# Altium schematic sheet Sheet1.SchDoc
size A; SheetNumber: 1; SheetTotal: 1
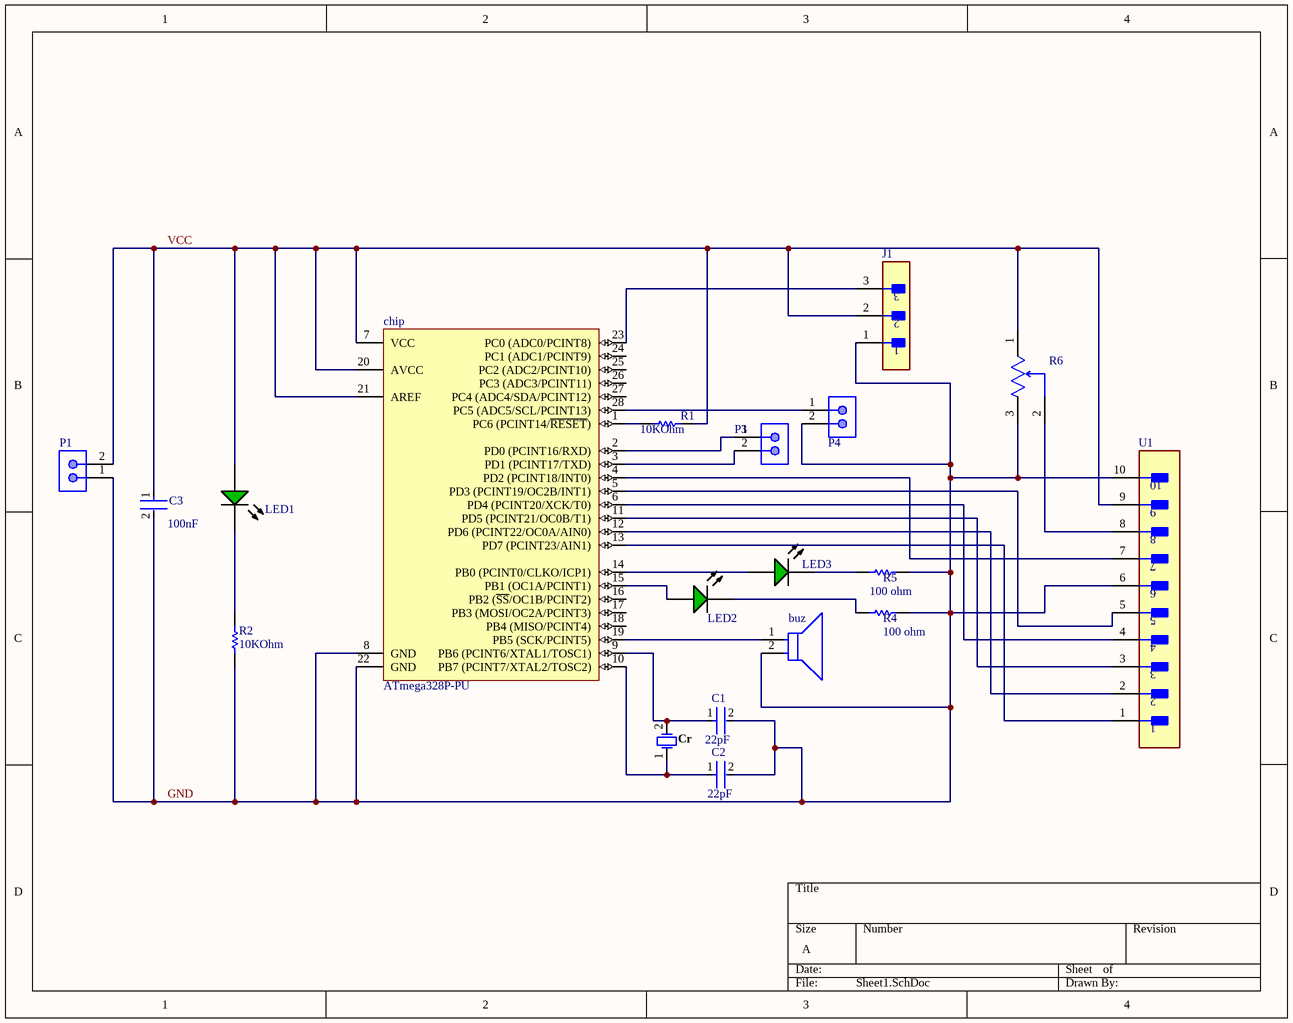
[diagram p0: Sheet1.SchDoc]

## Parts
buz  PS1440P02BT  [FP-PS1440P02BT-MFG]  (value not drawn)
C1  Capacitance: 22pF  [FP-RCE0DB-MFG]  (hidden comment: RCE5C2A220J0DBH03A)
C2  Capacitance: 22pF  [FP-RCE0DB-MFG]  (hidden comment: RCE5C2A220J0DBH03A)
C3  Capacitance: 100nF  [FP-K15H5-MFG]  (hidden comment: K104K15X7RF53H5)
chip  ATmega328P-PU  [28P3]
Cr  FOXSLF/160-20  [FOX-FOXSLF160-20]  (value not drawn)
J1  TMM-103-03-T-S  [FP-TMM-103-03-T-S-MFG]  (value not drawn)
LED1  HLMP-1790  [LED-2P-2.54-3MM_V]  (value not drawn)
LED2  HLMP-1790  [LED-2P-2.54-3MM_V]  (value not drawn)
LED3  HLMP-1790  [LED-2P-2.54-3MM_V]  (value not drawn)
P1  22-27-2021  [MOLX-22-27-2021_V]  (value not drawn)
P3  22-27-2021  [MOLX-22-27-2021_V]  (value not drawn)
P4  22-27-2021  [MOLX-22-27-2021_V]  (value not drawn)
R1  Resistance: 10KOhm  [RESA60-630X240]  (hidden comment: MFR-25FBF5210K)
R2  Resistance: 10KOhm  [RESA60-630X240]  (hidden comment: MFR-25FBF5210K)
R4  Resistance: 100 ohm  [RESA60-630X240]  (hidden comment: MFR-25FBF52-1K)
R5  Resistance: 100 ohm  [RESA60-630X240]  (hidden comment: MFR-25FBF52-1K)
R6  3296W-1-202LF  [FP-3296W-MFG]  (value not drawn)
U1  61301011121  [FP-61301011121-MFG]  (value not drawn)

## Nets
GND: buz.2 C1.2 C2.2 C3.2 chip.8(GND) chip.22(GND) J1.1 P1.1 P4.2 R2.1 R4.2 R5.2 R6.3(CW) U1.6 U1.10
VCC: C3.1 chip.7(VCC) chip.20(AVCC) chip.21(AREF) J1.2 LED1.1(A) P1.2 R1.2 R6.1(CCW) U1.9
Netbuz_1: buz.1 chip.19(PB5_(SCK/PCINT5))
NetC1_1: C1.1 chip.9(PB6_(PCINT6/XTAL1/TOSC1)) Cr.2
NetC2_1: C2.1 chip.10(PB7_(PCINT7/XTAL2/TOSC2)) Cr.1
Netchip_1: chip.1(PC6_(PCINT14/~{RESET})) R1.1
Netchip_2: chip.2(PD0_(PCINT16/RXD)) P3.1
Netchip_3: chip.3(PD1_(PCINT17/TXD)) P3.2
Netchip_4: chip.4(PD2_(PCINT18/INT0)) U1.7
Netchip_5: chip.5(PD3_(PCINT19/OC2B/INT1)) U1.5
Netchip_6: chip.6(PD4_(PCINT20/XCK/T0)) U1.4
Netchip_11: chip.11(PD5_(PCINT21/OC0B/T1)) U1.3
Netchip_12: chip.12(PD6_(PCINT22/OC0A/AIN0)) U1.2
Netchip_13: chip.13(PD7_(PCINT23/AIN1)) U1.1
Netchip_14: chip.14(PB0_(PCINT0/CLKO/ICP1)) LED3.1(A)
Netchip_15: chip.15(PB1_(OC1A/PCINT1)) LED2.1(A)
Netchip_23: chip.23(PC0_(ADC0/PCINT8)) J1.3
Netchip_28: chip.28(PC5_(ADC5/SCL/PCINT13)) P4.1
NetLED1_2: LED1.2(K) R2.2
NetLED2_2: LED2.2(K) R4.1
NetLED3_2: LED3.2(K) R5.1
NetR6_2: R6.2(WIPER) U1.8

Not connected (* = marked no-connect by the designer): chip 16(PB2_(~{SS}/OC1B/PCINT2)) 17(PB3_(MOSI/OC2A/PCINT3)) 18(PB4_(MISO/PCINT4)) 24(PC1_(ADC1/PCINT9)) 25(PC2_(ADC2/PCINT10)) 26(PC3_(ADC3/PCINT11)) 27(PC4_(ADC4/SDA/PCINT12))

## Library data of the parts
buz = CMP-08413-000003-1: AUDIO PIEZO TRANSDUCER 30V TH; Self Resonant Frequency: 4kHz; Washable: No; Voltage Rating (DC): 3V; Number of Terminals/Pins: 2; Packaging: Tape and Reel; Lead Free: Lead Free; Min Operating Temperature: -10°C; Package Quantity: 350; Termination: PC Pins; Mount: Through Hole; Max Operating Temperature: 70°C; Operating Supply Voltage: 3V; Diameter: 14mm; RoHS Compliant: Yes; Frequency: 4kHz; Height: 8mm
C1 C2 = CMP-06035-047347-1: Cap Ceramic 22pF 100V C0G ±5% Radial 2.5mm +125°C Ammo Pack; Lead Diameter: 0.5mm; Lead/Base Style: Straight; Height: 3.5mm; Voltage: 100V; Mount: Through Hole; Min Operating Temperature: -55°C; Height - Seated (Max): 0.138inch; Dielectric: C0G; Width: 0.098inch; Depth: 2.5mm; Lead Pitch: 0.098inch; Packaging: Tape and Reel; Voltage Rating (DC): 100V; Package Quantity: 2000; Max Operating Temperature: 125°C; Tolerance: 5%; Termination: Radial; Voltage Rating: 100V; Case/Package: Radial; Resistor Type: Ceramic; Length: 3.6mm; Ratings: AEC-Q200
C3 = CMP-02417-000048-1: CAP CER 0.1UF 50V X7R RADIAL; Tolerance: 10%; Lead/Base Style: Formed Leads; Lead Length: 30mm; Lead Diameter: 0.5mm; Radiation Hardening: No; Lead Pitch: 5mm; Voltage: 50V; Mount: Through Hole; Package Quantity: 5000; Series: K; Case/Package: Dipped; Min Operating Temperature: -55°C; Depth: 2.5mm; Height - Seated (Max): 0.1inch; Voltage Rating (DC): 50V; Packaging: Bulk; RoHS Compliant: Yes; Construction: RADIAL; Thickness: 2.6mm; Max Operating Temperature: 125°C; Voltage Rating: 50V; Diameter: 500um; Dielectric: X7R; Width: 2.5mm; Length: 4mm; Weight: 0.005644oz; Termination: Radial; Height: 4mm
chip = CMP-0095-00013-2: 8-bit AVR Microcontroller, 32KB Flash, 1KB EEPROM, 2KB SRAM, 28-pin PDIP, Industrial Grade (-40°C to 85°C); RevisionNote: DatasheetVersion updated. URLs added.; PackageVersion: revB, Sep-2001; PackageDescription: 28-lead (0.300"/7.62mm Wide) Plastic Dual Inline Package (PDIP); DatasheetVersion: revD, May-2011; ComponentLink1Description: Manufacturer URL; ComponentLink1URL: http://www.atmel.com/; PackageReference: 28P3; ComponentLink2Description: ATmega48A/48PA/88A/88PA/168A/168PA/328/328P Datasheet; ComponentLink3URL: http://www.atmel.com/dyn/resources/prod_documents/8271S.pdf; ComponentLink2URL: http://www.atmel.com/dyn/resources/prod_documents/8271.pdf; ComponentLink3Description: ATmega48A/48PA/88A/88PA/168A/168PA/328/328P Summary
Cr = CMP-1749-00003-1: Resistance Weld Thru-Hole Crystal, 16 MHz, -20 to 70 degC, 2-Pin THD, RoHS, Bulk; Voltage Rating: 250 V; Tolerance: 1%; Resistance: 221 kohm; Case\Package: Axial; Power Rating: 250 mW; RoHSCompliant: true; Package Quantity: 200; Packaging: Bulk; Min Operating Temperature: -55 degC; DatasheetVersion: Mar-15; ComponentLink1URL: http://www.foxonline.com/; Max Operating Temperature: 155 degC; PackageReference: FOXSLF160-20; Mount: Through Hole; PackageDescription: 2-Pin Through Hole Device, Body 11.35 x 4.65 mm; ComponentLink1Description: Manufacturer URL; ComponentLink2URL: http://www.foxonline.com/pdfs/hc49slf.pdf; ComponentLink2Description: Datasheet; Length: 0.248 inch
J1 = CMP-02766-001695-1: CONN HEADER VERT 3POS 2MM; Gender: Male; Number of Positions: 3; Max Current Rating: 3.9A; Max Voltage Rating (AC): 500V; Packaging: Bulk; RoHS Compliant: Yes; Mount: Through Hole; Length: 6mm; Contact Type: Male Pin; Package Quantity: 1; Depth: 1.97mm; Contact Material: Bronze; Insulation Material: Polymer; Series: TMM; Contact Plating: Tin; Fastening Type: Pull; Housing Color: Black; Pitch: 2mm; Termination: Solder; Contact Mating Length: 0.157inch; Min Operating Temperature: -55°C; REACH SVHC: No SVHC; Orientation: Straight; Number of Rows: 1; Color: Black; Insulation Color: Black; Connector Type: Header; Radiation Hardening: No; Number of Contacts: 3; Lead Free: Lead Free; Contact Finish - Mating: TIN; Max Operating Temperature: 105°C; Housing Material: Polymer; Contact Shape: Square
LED1-LED3 = CMP-2000-05186-1: LED, Green, 2 mA, 1.9 V, -20 to 100 degC, 2-Pin THD, RoHS, Bulk; Manufacturer: Avago; Viewing Angle: 50deg; Number of LEDs: 1; Lens Appearance: ColoredDiffused; Peak Wavelength: 565nm; Dominant Wavelength/Color Temperature: 569nm; Mounting Orientation: TopMount; Rad Hard: No; Lens Shape Type: Circular; Type: Uni-Color; Intensity: 2.3mcd; Package: 2T-1; Packaging: Bulk; Pin Count: 2; Color: Green; Datasheet URL: https://datasheet.ciiva.com/11773/0900766b800204ad-11773539.pdf; Manufacturer URL: http://www.avagotech.com/; Category: LEDs; Mounting: ThroughHole; Datasheet Version: Jul-14
P1 P3 P4 = CMP-2000-05537-1: Male Header, Pitch 2.54 mm, 1 x 2 Position, Height 11.7 mm, Tail Length 3.56 mm, 0 to 75 degC, RoHS, Bulk; Manufacturer: Molex; PartNumber: 0022272021; Current rating: 4A; Package Version: Rev. BC, 02/2012; Voltage rating: 250V; No. of Positions: 2; Pitch: 2.54mm; No. of Rows: 1; Orientation: Vertical; Operating temperature: 0°Cto+75°C; Manufacturer URL: http://www.molex.com/; Mounting Technology: ThroughHole; Housing material: Nylon(UL94V-0); Package Description: 2-Leads Header, Body 5.08 x 5.8 mm, Pitch 2.54 mm; Voltage - Max: 250V; Datasheet URL: http://www.molex.com/pdm_docs/sd/022272021_sd.pdf; Package Reference: 22-27-2021; Contact material: Tinplatedbrass; Current - Max: 4A; Datasheet Version: Rev. F, 06/2009
R1 R2 = CMP-1659-00074-2: Axial Resistor, 10 KOhm, +/- 1%, 0.25 W, -55 to 155 degC, 2-Pin THD, RoHS, Bulk; Manufacturer: Yageo; Temperature Coefficient: 100ppm\/degreesC; Voltage Rating: 250V; Voltage Rating (DC): 200V; Max Power Dissipation: 250mW; Datasheet URL: http://www.yageo.com/documents/recent/Yageo%20LR_MFR_2013.pdf; Packaging: Bulk; RoHSCompliant: True; Mount: ThroughHole; Package Reference: MFR-25; Termination: Axial; Composition: MetalFilm; Number of Terminations: 2; Package Quantity: 200; Mounting Technology: ThroughHole; Length: 0.248inch; Max Operating Temperature: 155degC; Min Operating Temperature: -55degC; Datasheet Version: 04/2013; Lead Free: LeadFree; Manufacturer URL: http://www.yageo.com/; Tolerance: 1%; Power Rating: 250mW; Package Description: 2-Pin Axial Lead, Dia 2.4 mm, Body Length 6.3 mm; Military Standard: Not; Case\/Package: Axial
R4 R5 = CMP-1659-00075-1: Axial Resistor, 1 KOhm, +/- 1%, 250 mW, -55 to 155 degC, 2-Pin THD, RoHS, Bulk; Voltage Rating: 250 V; Power Rating: 250 mW; ComponentLink2Description: Datasheet; RoHSCompliant: true; PackageReference: MFR-25; Case\Package: Axial; Max Operating Temperature: 155 degC; DatasheetVersion: Apr-13; Tolerance: 1%; ComponentLink1URL: http://www.yageo.com/; Length: 0.248 inch; ComponentLink2URL: http://www.yageo.com/documents/recent/Yageo%20LR_MFR_2013.pdf; Packaging: Bulk; Package Quantity: 200; PackageDescription: 2-Pin Axial Lead, Dia 2.4 mm, Body Length 6.3 mm; Min Operating Temperature: -55 degC; ComponentLink1Description: Manufacturer URL
R6 = CMP-2000-05582-2: TRIMMER 2K OHM 0.5W PC PIN TOP; Resistance Tolerance: 10%; Max Power Dissipation: 500mW; Number of Turns: 25; Temperature Coefficient: 100ppm/°C; Resistance: 2kR; Taper: Linear; Width: 9.53mm; Radiation Hardening: No; Length: 9.53mm; Packaging: Rail/Tube; Lead Free: Lead Free; Mount: Panel; Min Operating Temperature: -55°C; Power Rating: 500mW; RoHS Compliant: Yes; REACH SVHC: No SVHC; Color: Blue; Package Quantity: 50; Contact Plating: Tin; Weight: 0.03oz; Technology: CERMET; Max Operating Temperature: 125°C; Tolerance: 10%; Termination: Pin; Resistor Type: Cermet; Military Standard: Not; Height: 0.395inch; Series: 3296; Depth: 4.83mm
U1 = CMP-1502-01082-3: CONN HEADER VERT 10POS 2.54MM; Gender: Male; Insulation Resistance: 1GR; Number of Contacts: 10; Current Rating: 3A; Voltage Rating: 250V; Contact Mating Length: 0.236inch; Termination: Solder; Insulation Material: Nylon; Fastening Type: Pull; RoHS Compliant: Yes; Height: 11.54mm; Contact Plating: Gold; Series: WR-PHD; Length: 2.54mm; Mount: Through Hole; Contact Shape: Square; Package Quantity: 1000; Contact Gender: Male; Housing Material: PBT; Color: Black; Orientation: Straight; Number of Rows: 1; Connector Type: Header; Contact Type: Male Pin; Insulation Color: Black; Width: 25.4mm; Min Operating Temperature: -40°C; Contact Material: Copper Alloy; Number of Positions: 10; Contact Finish - Mating: GOLD; Pitch: 2.54mm; Flammability Rating: UL94 V-0; Max Operating Temperature: 105°C; Packaging: Bulk